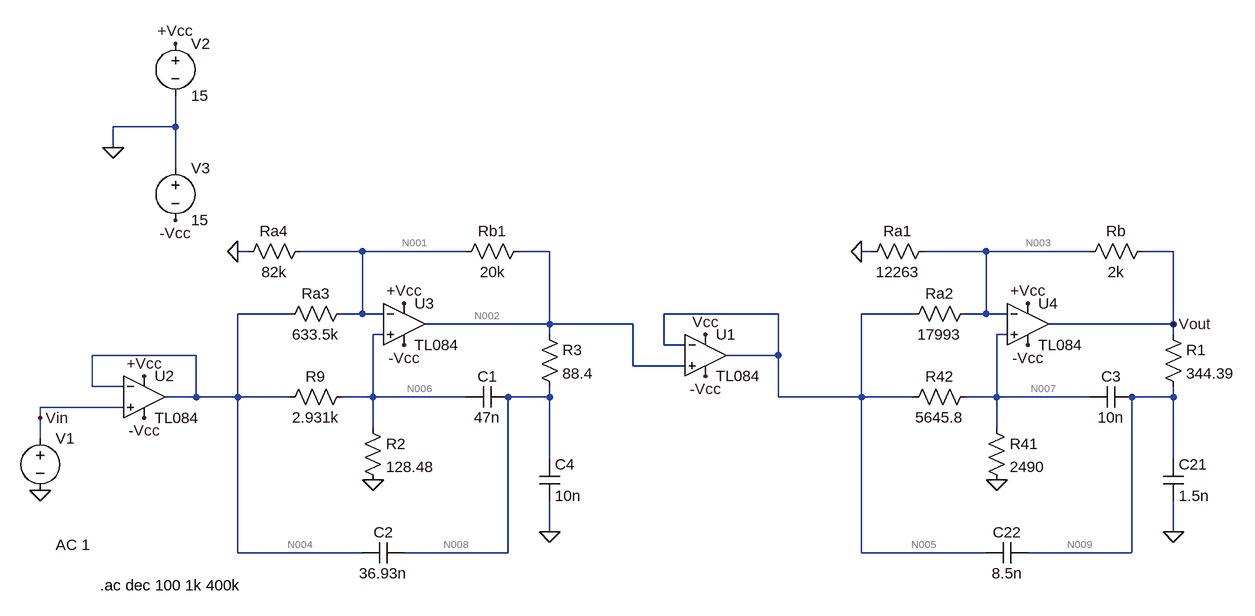
[diagram p0: schematic Sedra_double_buffer.asc]
* Sedra_double_buffer.asc
V1 Vin 0 AC 1
R42 N007 N005 5645.8
Ra2 N003 N005 17993
R41 N007 0 2490
C3 N009 N007 10n
C22 N009 N005 8.5n
Ra1 N003 0 12263
Rb Vout N003 2k
C21 N009 0 1.5n
V2 +Vcc 0 15
V3 0 -Vcc 15
R9 N006 N004 2.931k
Ra3 N001 N004 633.5k
R2 N006 0 128.48
C1 N008 N006 47n
C2 N008 N004 36.93n
Ra4 N001 0 82k
Rb1 N002 N001 20k
C4 N008 0 10n
R1 Vout N009 344.39
R3 N002 N008 88.4
* U3: TL084 (symbol sympropio\TL084 not available, pins judged from their places): In+=N006 In-=N001 V+=+Vcc V-=-Vcc OUT=N002
* U4: TL084 (symbol sympropio\TL084 not available, pins judged from their places): In+=N007 In-=N003 V+=+Vcc V-=-Vcc OUT=Vout
* U1: TL084 (symbol sympropio\TL084 not available, pins judged from their places): In+=N002 In-=N005 V+=Vcc V-=-Vcc OUT=N005
* U2: TL084 (symbol sympropio\TL084 not available, pins judged from their places): In+=Vin In-=N004 V+=+Vcc V-=-Vcc OUT=N004
.ac dec 100 1k 400k
.backanno
.end

* Results of the author's LTspice run, read from the files saved beside the schematic
* Operating Point, zero values left out:
*   V(n007) = -4.141 V
*   V(n005) = -13.53 V
*   V(n003) = -4.14 V
*   V(n009) = -3.772 V
*   V(vout) = -3.772 V
*   V(+vcc) = 15 V
*   V(-vcc) = -15 V
*   V(n006) = 455.2 nV
*   V(n004) = 10.97 µV
*   V(n001) = 11.43 µV
*   V(n008) = 15.13 µV
*   V(n002) = 15.13 µV
*   V(vcc) = -12.06 V
*   I(Rb1) = 185.1 pA
*   I(Ra4) = 139.3 pA
*   I(R2) = 3.543 nA
*   I(R9) = -3.588 nA
*   I(Rb) = 184.1 µA
*   I(Ra1) = -337.6 µA
*   I(R41) = -1.663 mA
*   I(Ra2) = 521.8 µA
*   I(R42) = 1.663 mA
*   I(V3) = -42.77 mA
*   I(V2) = -42.58 mA
*   I(V1) = -45.05 pA
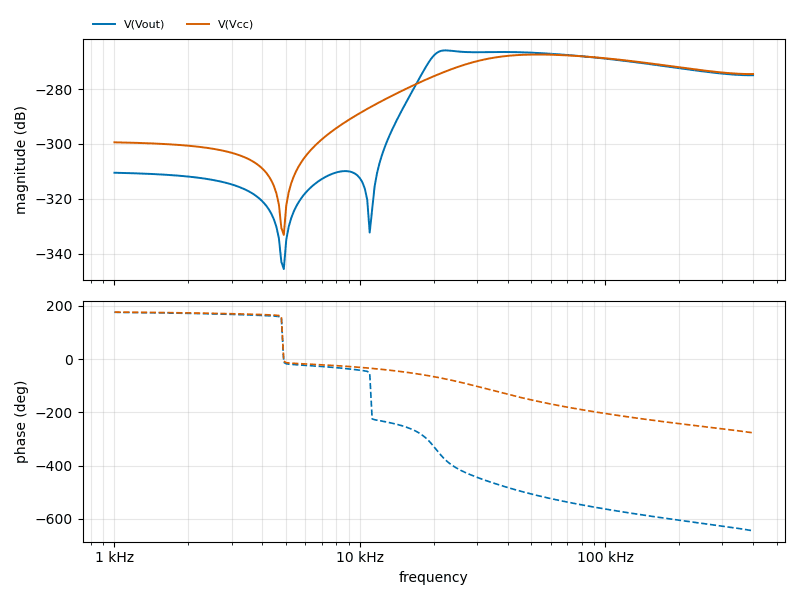
[diagram p1: AC Analysis of Sedra_double_buffer.asc, plotted from the saved traces]
* AC Analysis, 1 run:
*   V(Vout): -310.47 dB at 1 kHz, -274.97 dB at 400 kHz, peak -265.91 dB at 22.39 kHz, 3 dB below the peak at 19.53 kHz and 100.3 kHz
*   V(Vcc): -299.40 dB at 1 kHz, -274.52 dB at 400 kHz, peak -267.43 dB at 52.48 kHz, 3 dB below the peak at 28.36 kHz and 145.8 kHz